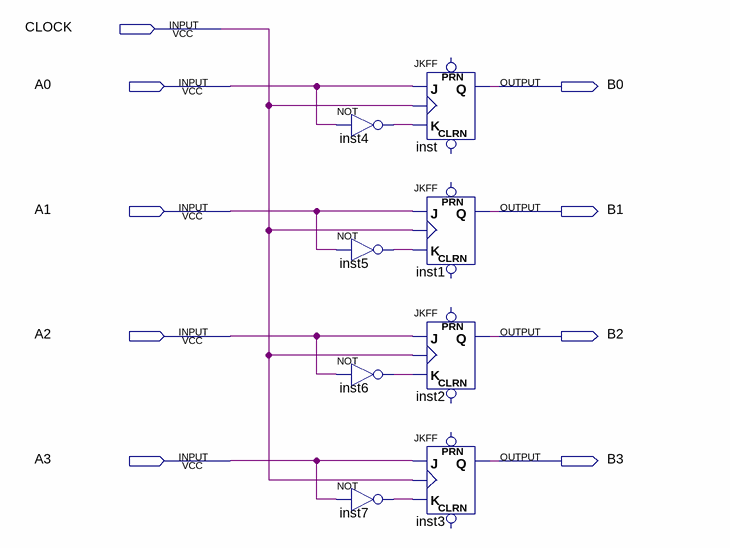
[diagram p0: schematic sheet]
// Quartus schematic registrador.bdf as structural Verilog: 8 symbols, 9 pins
module registrador (
  input  CLOCK,
  input  A0,
  input  A1,
  input  A2,
  input  A3,
  output B0,
  output B1,
  output B2,
  output B3
);

  wire inst4_out, inst5_out, inst6_out, inst7_out;

  not inst4 (inst4_out, A0);
  not inst5 (inst5_out, A1);
  not inst6 (inst6_out, A2);
  not inst7 (inst7_out, A3);
  JKFF inst (.K(inst4_out), .J(A0), .CLK(CLOCK), .Q(B0));  // open: PRN, CLRN
  JKFF inst1 (.K(inst5_out), .J(A1), .CLK(CLOCK), .Q(B1));  // open: PRN, CLRN
  JKFF inst2 (.K(inst6_out), .J(A2), .CLK(CLOCK), .Q(B2));  // open: PRN, CLRN
  JKFF inst3 (.K(inst7_out), .J(A3), .CLK(CLOCK), .Q(B3));  // open: PRN, CLRN
endmodule
